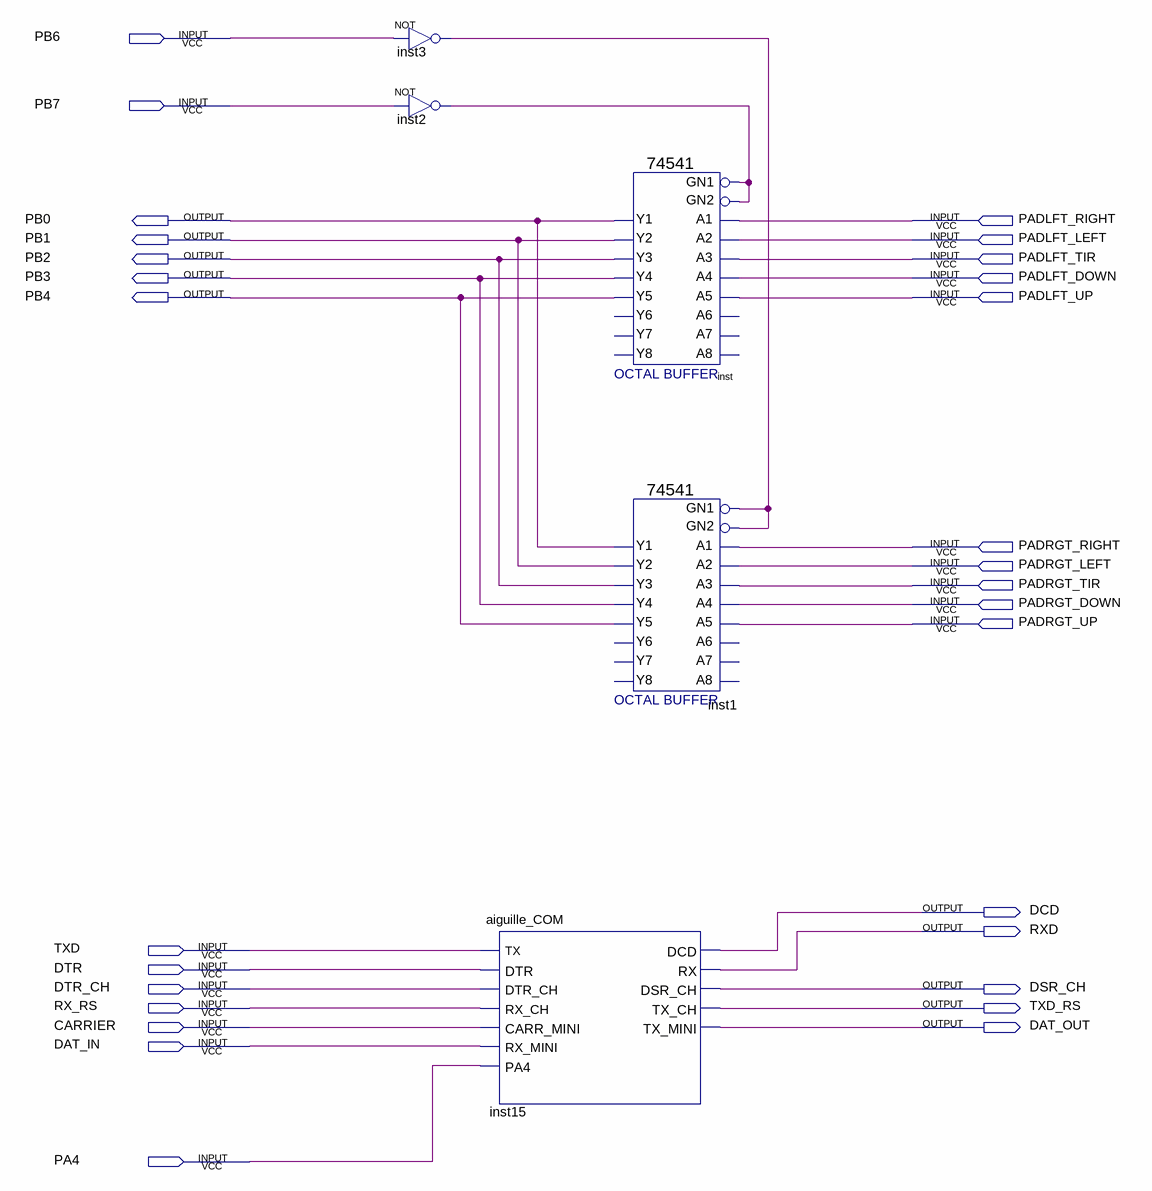
[diagram p0: schematic sheet]
// Quartus schematic JOYSTICK.bdf as structural Verilog: 5 symbols, 29 pins
module JOYSTICK (
  input  PB6,
  input  PB7,
  input  PADLFT_RIGHT,
  input  PADLFT_LEFT,
  input  PADLFT_TIR,
  input  PADLFT_DOWN,
  input  PADLFT_UP,
  input  PADRGT_RIGHT,
  input  PADRGT_LEFT,
  input  PADRGT_TIR,
  input  PADRGT_DOWN,
  input  PADRGT_UP,
  input  TXD,
  input  DTR,
  input  DTR_CH,
  input  RX_RS,
  input  CARRIER,
  input  DAT_IN,
  input  PA4,
  output PB0,
  output PB1,
  output PB2,
  output PB3,
  output PB4,
  output DCD,
  output RXD,
  output DSR_CH,
  output TXD_RS,
  output DAT_OUT
);

  wire inst2_out, inst3_out;

  not inst3 (inst3_out, PB6);
  not inst2 (inst2_out, PB7);
  aiguille_COM inst15 (
    .TX(TXD), .DTR(DTR), .DTR_CH(DTR_CH), .RX_CH(RX_RS), .CARR_MINI(CARRIER), .RX_MINI(DAT_IN), .PA4(PA4),
    .DCD(DCD), .RX(RXD), .DSR_CH(DSR_CH), .TX_CH(TXD_RS), .TX_MINI(DAT_OUT));
  \74541  inst (
    .GN2(inst2_out), .A1(PADLFT_RIGHT), .A4(PADLFT_DOWN), .A3(PADLFT_TIR), .A2(PADLFT_LEFT), .A5(PADLFT_UP),
    .GN1(inst2_out), .Y5(PB4), .Y2(PB1), .Y3(PB2), .Y4(PB3), .Y1(PB0));  // open: A7, A6, A8, Y8, Y6, Y7
  \74541  inst1 (
    .GN2(inst3_out), .A1(PADRGT_RIGHT), .A4(PADRGT_DOWN), .A3(PADRGT_TIR), .A2(PADRGT_LEFT), .A5(PADRGT_UP),
    .GN1(inst3_out), .Y5(PB4), .Y2(PB1), .Y3(PB2), .Y4(PB3), .Y1(PB0));  // open: A7, A6, A8, Y8, Y6, Y7
endmodule
